# EAGLE schematic dbt_shield_v2_v23 (EAGLE 9.7.0)

## Sheet 1 of 4
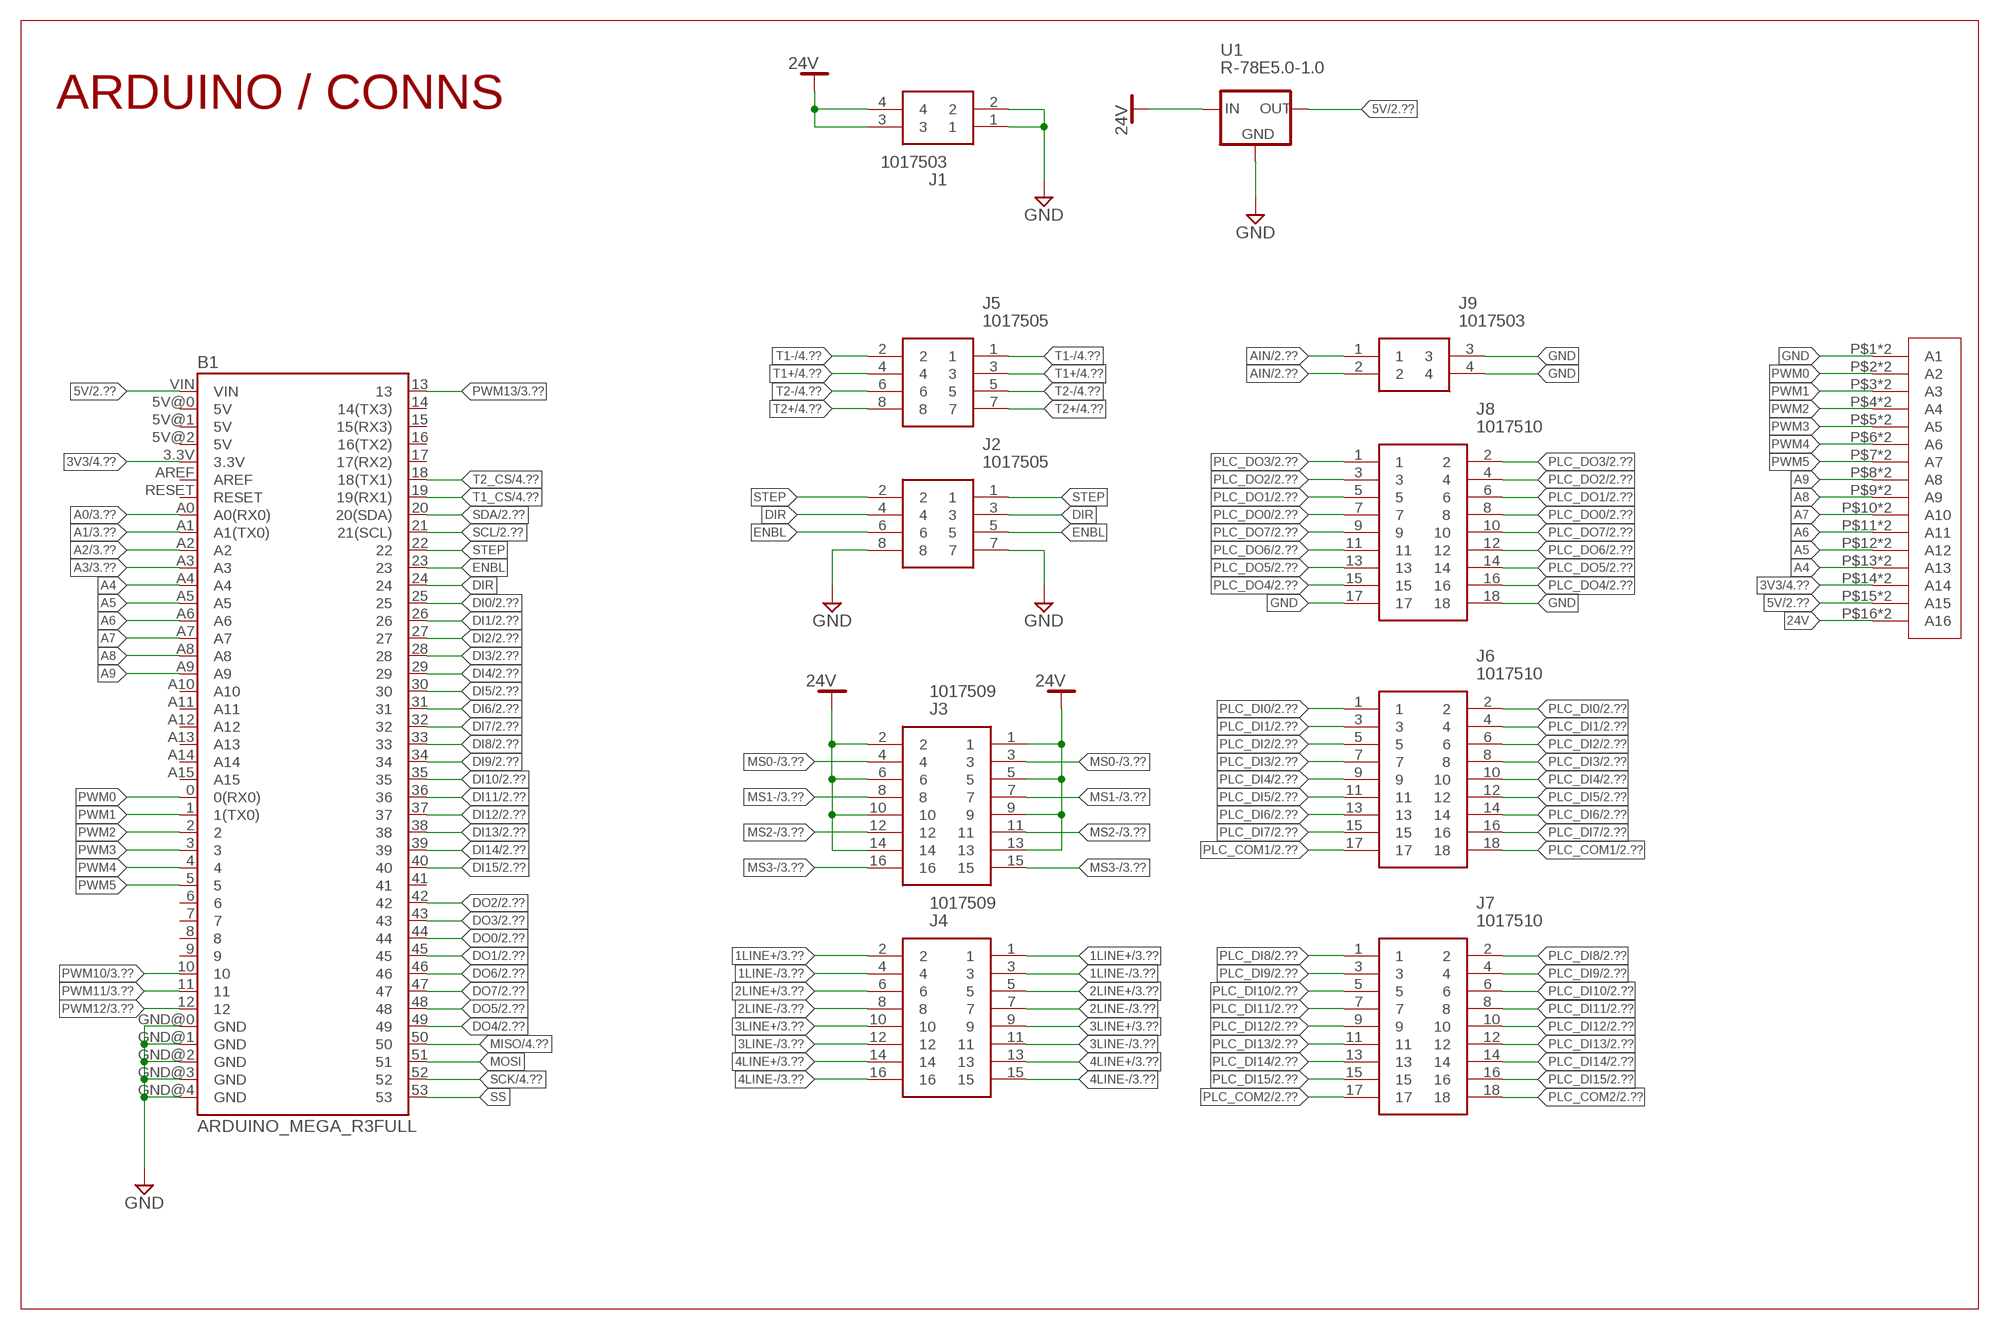
[diagram p0: schematic, sheet 1]

### Parts
B1  ARDUINO_MEGA_R3FULL  [ARDUINO_MEGA]
J1  1017503  [1017503]
J2  1017505  [1017505]
J3  1017509  [1017509]
J4  1017509  [1017509]
J5  1017505  [1017505]
J6  1017510  [SHDR18W120P870X508_2X9_4652X18]
J7  1017510  [SHDR18W120P870X508_2X9_4652X18]
J8  1017510  [SHDR18W120P870X508_2X9_4652X18]
J9  1017503  [1017503]
U1  R-78E5.0-1.0  [DC-DC_CONVERTER_78XX]
U$1  1861991  [1861991]

### Nets
1LINE+: J4.1 J4.2 ; also sheet 3
1LINE-: J4.3 J4.4 ; also sheet 3
2LINE+: J4.5 J4.6 ; also sheet 3
2LINE-: J4.7 J4.8 ; also sheet 3
3LINE+: J4.9 J4.10 ; also sheet 3
3LINE-: J4.11 J4.12 ; also sheet 3
3V3: B1.3.3V U$1.P$14(A14) U$1.P$30(A14) ; also sheet 4
4LINE+: J4.13 J4.14 ; also sheet 3
4LINE-: J4.15 J4.16 ; also sheet 3
5V: B1.VIN U1.VOUT(OUT) U$1.P$15(A15) U$1.P$31(A15) ; also sheet 2,3
24V: J1.3 J1.4 J3.1 J3.2 J3.5 J3.6 J3.9 J3.10 J3.13 J3.14 U1.VIN(IN) U$1.P$16(A16) U$1.P$32(A16) ; also sheet 2,3
A0: B1.A0(A0(RX0)) ; also sheet 3
A1: B1.A1(A1(TX0)) ; also sheet 3
A2: B1.A2 ; also sheet 3
A3: B1.A3 ; also sheet 3
A4: B1.A4 U$1.P$13(A13) U$1.P$29(A13)
A5: B1.A5 U$1.P$12(A12) U$1.P$28(A12)
A6: B1.A6 U$1.P$11(A11) U$1.P$27(A11)
A7: B1.A7 U$1.P$10(A10) U$1.P$26(A10)
A8: B1.A8 U$1.P$9(A9) U$1.P$25(A9)
A9: B1.A9 U$1.P$8(A8) U$1.P$24(A8)
AIN: J9.1 J9.2 ; also sheet 2
DI0: B1.25 ; also sheet 2
DI1: B1.26 ; also sheet 2
DI2: B1.27 ; also sheet 2
DI3: B1.28 ; also sheet 2
DI4: B1.29 ; also sheet 2
DI5: B1.30 ; also sheet 2
DI6: B1.31 ; also sheet 2
DI7: B1.32 ; also sheet 2
DI8: B1.33 ; also sheet 2
DI9: B1.34 ; also sheet 2
DI10: B1.35 ; also sheet 2
DI11: B1.36 ; also sheet 2
DI12: B1.37 ; also sheet 2
DI13: B1.38 ; also sheet 2
DI14: B1.39 ; also sheet 2
DI15: B1.40 ; also sheet 2
DIR: B1.24 J2.3 J2.4
DO0: B1.44 ; also sheet 2
DO1: B1.45 ; also sheet 2
DO2: B1.42 ; also sheet 2
DO3: B1.43 ; also sheet 2
DO4: B1.49 ; also sheet 2
DO5: B1.48 ; also sheet 2
DO6: B1.46 ; also sheet 2
DO7: B1.47 ; also sheet 2
ENBL: B1.23 J2.5 J2.6
GND: B1.GND@0(GND) B1.GND@1(GND) B1.GND@2(GND) B1.GND@3(GND) B1.GND@4(GND) J1.1 J1.2 J2.7 J2.8 J8.17 J8.18 J9.3 J9.4 U1.GND U$1.P$1(A1) U$1.P$17(A1) ; also sheet 2,3,4
MISO: B1.50 ; also sheet 4
MOSI: B1.51
MS0-: J3.3 J3.4 ; also sheet 3
MS1-: J3.7 J3.8 ; also sheet 3
MS2-: J3.11 J3.12 ; also sheet 3
MS3-: J3.15 J3.16 ; also sheet 3
PLC_COM1: J6.17 J6.18 ; also sheet 2
PLC_COM2: J7.17 J7.18 ; also sheet 2
PLC_DI0: J6.1 J6.2 ; also sheet 2
PLC_DI1: J6.3 J6.4 ; also sheet 2
PLC_DI2: J6.5 J6.6 ; also sheet 2
PLC_DI3: J6.7 J6.8 ; also sheet 2
PLC_DI4: J6.9 J6.10 ; also sheet 2
PLC_DI5: J6.11 J6.12 ; also sheet 2
PLC_DI6: J6.13 J6.14 ; also sheet 2
PLC_DI7: J6.15 J6.16 ; also sheet 2
PLC_DI8: J7.1 J7.2 ; also sheet 2
PLC_DI9: J7.3 J7.4 ; also sheet 2
PLC_DI10: J7.5 J7.6 ; also sheet 2
PLC_DI11: J7.7 J7.8 ; also sheet 2
PLC_DI12: J7.9 J7.10 ; also sheet 2
PLC_DI13: J7.11 J7.12 ; also sheet 2
PLC_DI14: J7.13 J7.14 ; also sheet 2
PLC_DI15: J7.15 J7.16 ; also sheet 2
PLC_DO0: J8.7 J8.8 ; also sheet 2
PLC_DO1: J8.5 J8.6 ; also sheet 2
PLC_DO2: J8.3 J8.4 ; also sheet 2
PLC_DO3: J8.1 J8.2 ; also sheet 2
PLC_DO4: J8.15 J8.16 ; also sheet 2
PLC_DO5: J8.13 J8.14 ; also sheet 2
PLC_DO6: J8.11 J8.12 ; also sheet 2
PLC_DO7: J8.9 J8.10 ; also sheet 2
PWM0: B1.0(0(RX0)) U$1.P$2(A2) U$1.P$18(A2)
PWM1: B1.1(1(TX0)) U$1.P$3(A3) U$1.P$19(A3)
PWM2: B1.2 U$1.P$4(A4) U$1.P$20(A4)
PWM3: B1.3 U$1.P$5(A5) U$1.P$21(A5)
PWM4: B1.4 U$1.P$6(A6) U$1.P$22(A6)
PWM5: B1.5 U$1.P$7(A7) U$1.P$23(A7)
PWM10: B1.10 ; also sheet 3
PWM11: B1.11 ; also sheet 3
PWM12: B1.12 ; also sheet 3
PWM13: B1.13 ; also sheet 3
SCK: B1.52 ; also sheet 4
SCL: B1.21(21(SCL)) ; also sheet 2
SDA: B1.20(20(SDA)) ; also sheet 2
SS: B1.53
STEP: B1.22 J2.1 J2.2
T1+: J5.3 J5.4 ; also sheet 4
T1-: J5.1 J5.2 ; also sheet 4
T1_CS: B1.19(19(RX1)) ; also sheet 4
T2+: J5.7 J5.8 ; also sheet 4
T2-: J5.5 J5.6 ; also sheet 4
T2_CS: B1.18(18(TX1)) ; also sheet 4
Unconnected: B1.5V@0(5V) B1.5V@1(5V) B1.5V@2(5V) B1.6 B1.7 B1.8 B1.9 B1.14(14(TX3)) B1.15(15(RX3)) B1.16(16(TX2)) B1.17(17(RX2)) B1.41 B1.A10 B1.A11 B1.A12 B1.A13 B1.A14 B1.A15 B1.AREF B1.RESET

### Notes on the sheet
- ARDUINO / CONNS

## Sheet 2 of 4
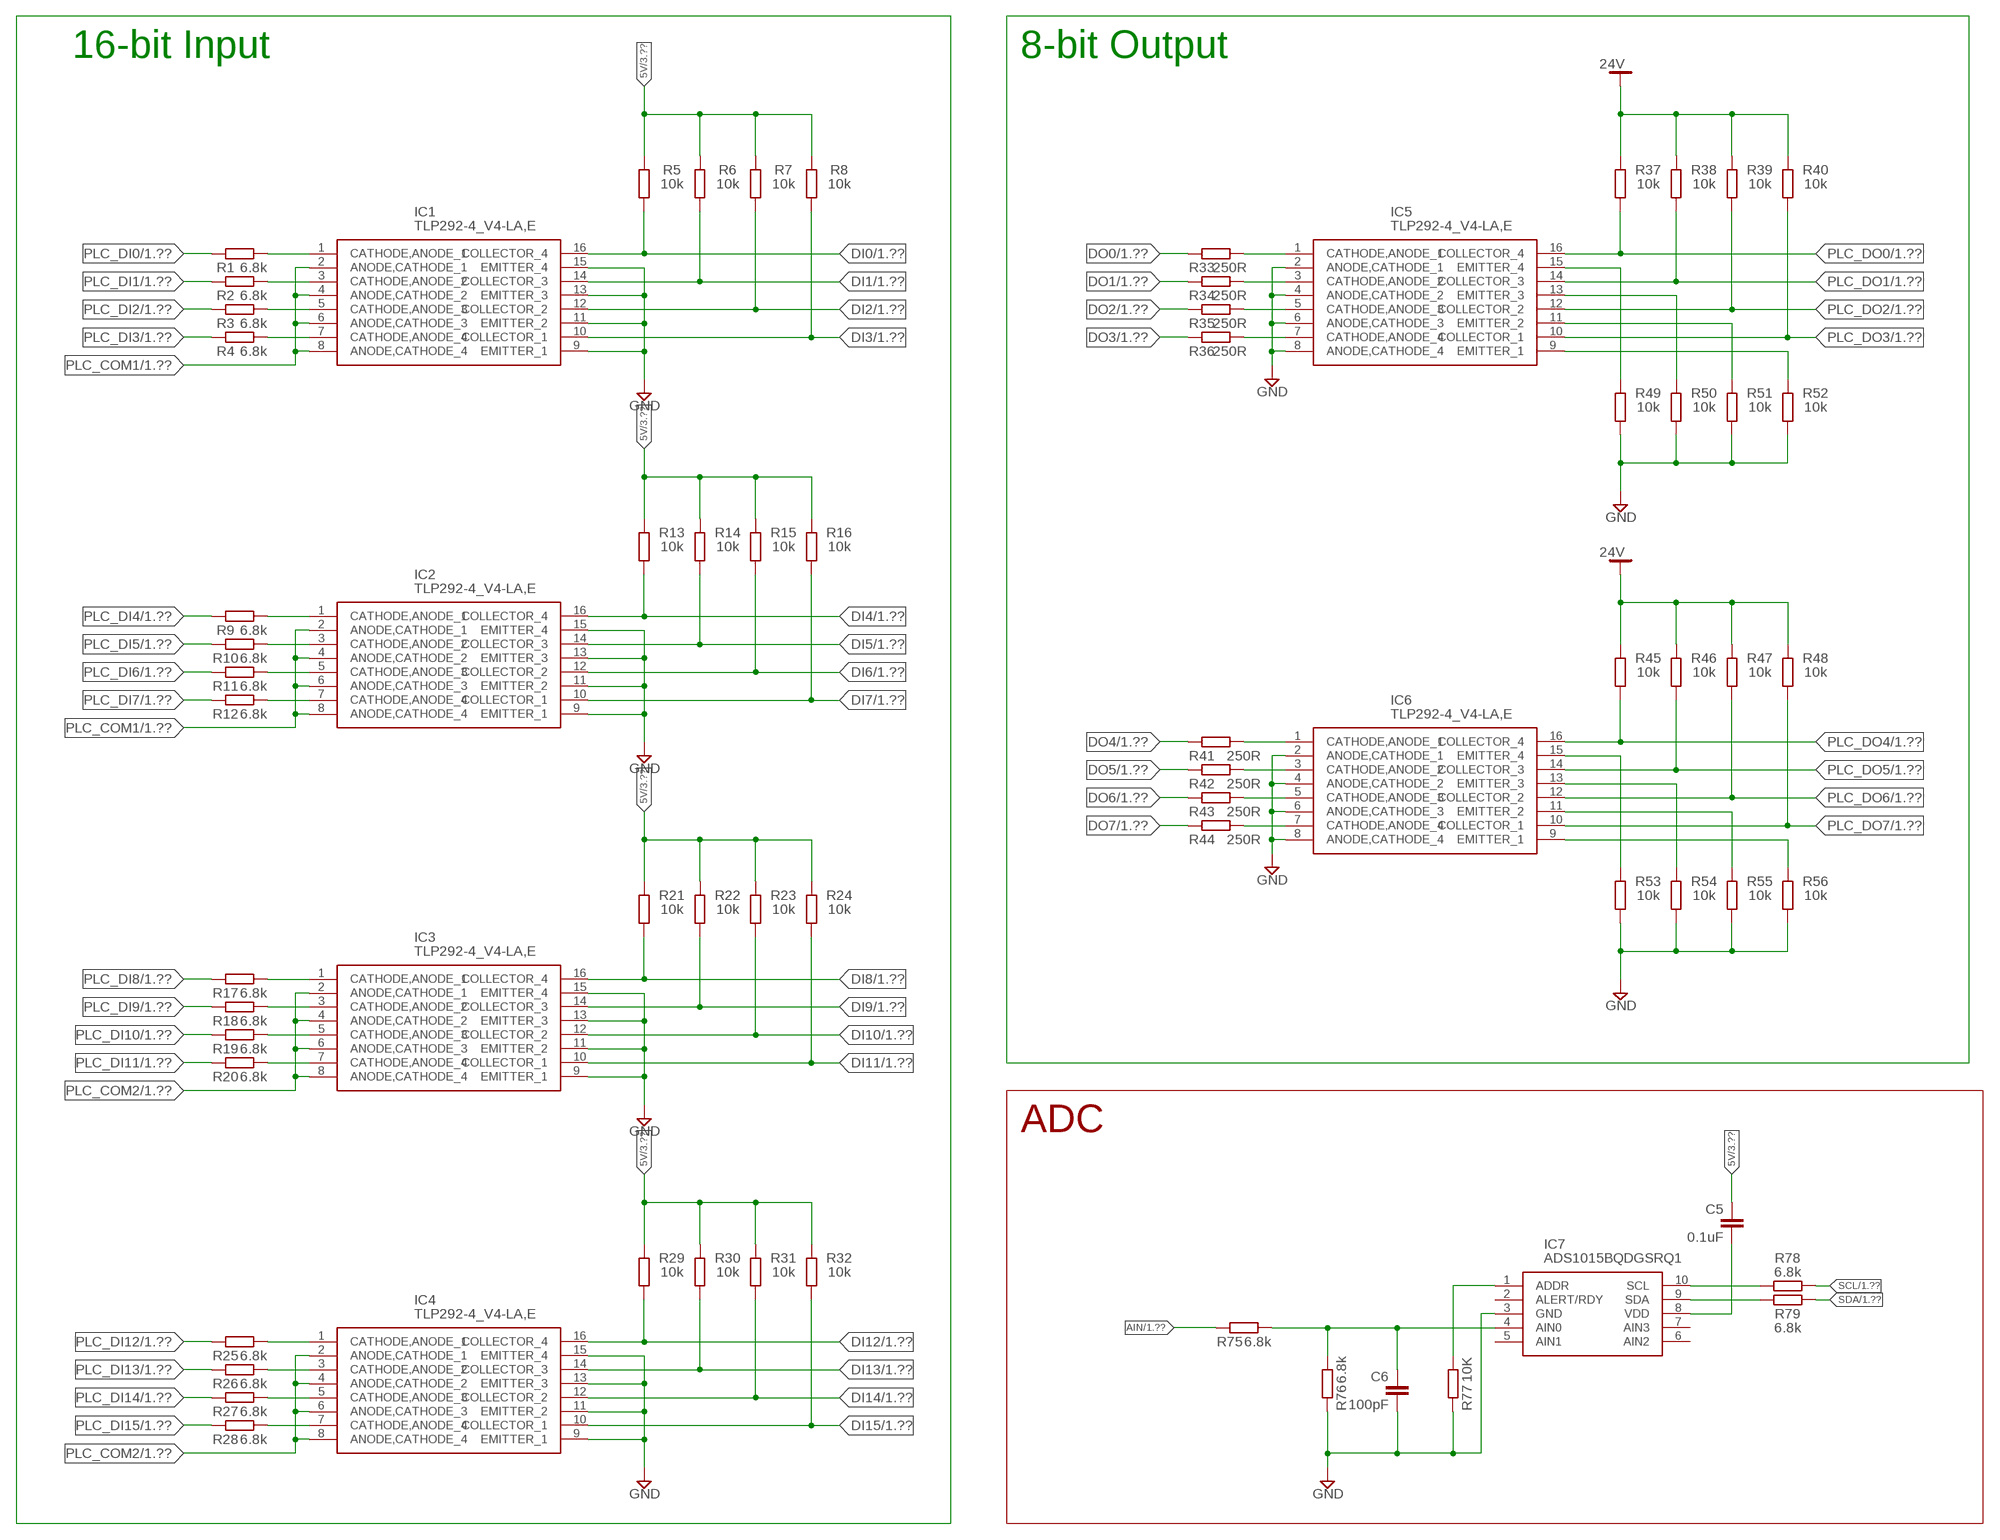
[diagram p1: schematic, sheet 2]

### Parts
C5  0.1uF  C_CHIP-1206(3216-METRIC)  [CAPC3216X135]
C6  100pF  C_CHIP-1206(3216-METRIC)  [CAPC3216X135]
IC1  TLP292-4_V4-LA,E  [SOIC127P700X230-16N]
IC2  TLP292-4_V4-LA,E  [SOIC127P700X230-16N]
IC3  TLP292-4_V4-LA,E  [SOIC127P700X230-16N]
IC4  TLP292-4_V4-LA,E  [SOIC127P700X230-16N]
IC5  TLP292-4_V4-LA,E  [SOIC127P700X230-16N]
IC6  TLP292-4_V4-LA,E  [SOIC127P700X230-16N]
IC7  ADS1015BQDGSRQ1  [SOP50P490X110-10N]
R1  6.8k  R_CHIP-1206(3216-METRIC)  [RESC3216X70]
R2  6.8k  R_CHIP-1206(3216-METRIC)  [RESC3216X70]
R3  6.8k  R_CHIP-1206(3216-METRIC)  [RESC3216X70]
R4  6.8k  R_CHIP-1206(3216-METRIC)  [RESC3216X70]
R5  10k  R_CHIP-1206(3216-METRIC)  [RESC3216X70]
R6  10k  R_CHIP-1206(3216-METRIC)  [RESC3216X70]
R7  10k  R_CHIP-1206(3216-METRIC)  [RESC3216X70]
R8  10k  R_CHIP-1206(3216-METRIC)  [RESC3216X70]
R9  6.8k  R_CHIP-1206(3216-METRIC)  [RESC3216X70]
R10  6.8k  R_CHIP-1206(3216-METRIC)  [RESC3216X70]
R11  6.8k  R_CHIP-1206(3216-METRIC)  [RESC3216X70]
R12  6.8k  R_CHIP-1206(3216-METRIC)  [RESC3216X70]
R13  10k  R_CHIP-1206(3216-METRIC)  [RESC3216X70]
R14  10k  R_CHIP-1206(3216-METRIC)  [RESC3216X70]
R15  10k  R_CHIP-1206(3216-METRIC)  [RESC3216X70]
R16  10k  R_CHIP-1206(3216-METRIC)  [RESC3216X70]
R17  6.8k  R_CHIP-1206(3216-METRIC)  [RESC3216X70]
R18  6.8k  R_CHIP-1206(3216-METRIC)  [RESC3216X70]
R19  6.8k  R_CHIP-1206(3216-METRIC)  [RESC3216X70]
R20  6.8k  R_CHIP-1206(3216-METRIC)  [RESC3216X70]
R21  10k  R_CHIP-1206(3216-METRIC)  [RESC3216X70]
R22  10k  R_CHIP-1206(3216-METRIC)  [RESC3216X70]
R23  10k  R_CHIP-1206(3216-METRIC)  [RESC3216X70]
R24  10k  R_CHIP-1206(3216-METRIC)  [RESC3216X70]
R25  6.8k  R_CHIP-1206(3216-METRIC)  [RESC3216X70]
R26  6.8k  R_CHIP-1206(3216-METRIC)  [RESC3216X70]
R27  6.8k  R_CHIP-1206(3216-METRIC)  [RESC3216X70]
R28  6.8k  R_CHIP-1206(3216-METRIC)  [RESC3216X70]
R29  10k  R_CHIP-1206(3216-METRIC)  [RESC3216X70]
R30  10k  R_CHIP-1206(3216-METRIC)  [RESC3216X70]
R31  10k  R_CHIP-1206(3216-METRIC)  [RESC3216X70]
R32  10k  R_CHIP-1206(3216-METRIC)  [RESC3216X70]
R33  250R  R_CHIP-1206(3216-METRIC)  [RESC3216X70]
R34  250R  R_CHIP-1206(3216-METRIC)  [RESC3216X70]
R35  250R  R_CHIP-1206(3216-METRIC)  [RESC3216X70]
R36  250R  R_CHIP-1206(3216-METRIC)  [RESC3216X70]
R37  10k  R_CHIP-1206(3216-METRIC)  [RESC3216X70]
R38  10k  R_CHIP-1206(3216-METRIC)  [RESC3216X70]
R39  10k  R_CHIP-1206(3216-METRIC)  [RESC3216X70]
R40  10k  R_CHIP-1206(3216-METRIC)  [RESC3216X70]
R41  250R  R_CHIP-1206(3216-METRIC)  [RESC3216X70]
R42  250R  R_CHIP-1206(3216-METRIC)  [RESC3216X70]
R43  250R  R_CHIP-1206(3216-METRIC)  [RESC3216X70]
R44  250R  R_CHIP-1206(3216-METRIC)  [RESC3216X70]
R45  10k  R_CHIP-1206(3216-METRIC)  [RESC3216X70]
R46  10k  R_CHIP-1206(3216-METRIC)  [RESC3216X70]
R47  10k  R_CHIP-1206(3216-METRIC)  [RESC3216X70]
R48  10k  R_CHIP-1206(3216-METRIC)  [RESC3216X70]
R49  10k  R_CHIP-1206(3216-METRIC)  [RESC3216X70]
R50  10k  R_CHIP-1206(3216-METRIC)  [RESC3216X70]
R51  10k  R_CHIP-1206(3216-METRIC)  [RESC3216X70]
R52  10k  R_CHIP-1206(3216-METRIC)  [RESC3216X70]
R53  10k  R_CHIP-1206(3216-METRIC)  [RESC3216X70]
R54  10k  R_CHIP-1206(3216-METRIC)  [RESC3216X70]
R55  10k  R_CHIP-1206(3216-METRIC)  [RESC3216X70]
R56  10k  R_CHIP-1206(3216-METRIC)  [RESC3216X70]
R75  6.8k  R_CHIP-1206(3216-METRIC)  [RESC3216X70]
R76  6.8k  R_CHIP-1206(3216-METRIC)  [RESC3216X70]
R77  10K  R_CHIP-1206(3216-METRIC)  [RESC3216X70]
R78  6.8k  R_CHIP-1206(3216-METRIC)  [RESC3216X70]
R79  6.8k  R_CHIP-1206(3216-METRIC)  [RESC3216X70]

### Nets
5V: C5.1 R5.2 R6.2 R7.2 R8.2 R13.2 R14.2 R15.2 R16.2 R21.2 R22.2 R23.2 R24.2 R29.2 R30.2 R31.2 R32.2 ; also sheet 1,3
24V: R37.2 R38.2 R39.2 R40.2 R45.2 R46.2 R47.2 R48.2 ; also sheet 1,3
AIN: R75.1 ; also sheet 1
DI0: IC1.16(COLLECTOR_4) R5.1 ; also sheet 1
DI1: IC1.14(COLLECTOR_3) R6.1 ; also sheet 1
DI2: IC1.12(COLLECTOR_2) R7.1 ; also sheet 1
DI3: IC1.10(COLLECTOR_1) R8.1 ; also sheet 1
DI4: IC2.16(COLLECTOR_4) R13.1 ; also sheet 1
DI5: IC2.14(COLLECTOR_3) R14.1 ; also sheet 1
DI6: IC2.12(COLLECTOR_2) R15.1 ; also sheet 1
DI7: IC2.10(COLLECTOR_1) R16.1 ; also sheet 1
DI8: IC3.16(COLLECTOR_4) R21.1 ; also sheet 1
DI9: IC3.14(COLLECTOR_3) R22.1 ; also sheet 1
DI10: IC3.12(COLLECTOR_2) R23.1 ; also sheet 1
DI11: IC3.10(COLLECTOR_1) R24.1 ; also sheet 1
DI12: IC4.16(COLLECTOR_4) R29.1 ; also sheet 1
DI13: IC4.14(COLLECTOR_3) R30.1 ; also sheet 1
DI14: IC4.12(COLLECTOR_2) R31.1 ; also sheet 1
DI15: IC4.10(COLLECTOR_1) R32.1 ; also sheet 1
DO0: R33.1 ; also sheet 1
DO1: R34.1 ; also sheet 1
DO2: R35.1 ; also sheet 1
DO3: R36.1 ; also sheet 1
DO4: R41.1 ; also sheet 1
DO5: R42.1 ; also sheet 1
DO6: R43.1 ; also sheet 1
DO7: R44.1 ; also sheet 1
GND: C6.2 IC1.9(EMITTER_1) IC1.11(EMITTER_2) IC1.13(EMITTER_3) IC1.15(EMITTER_4) IC2.9(EMITTER_1) IC2.11(EMITTER_2) IC2.13(EMITTER_3) IC2.15(EMITTER_4) IC3.9(EMITTER_1) IC3.11(EMITTER_2) IC3.13(EMITTER_3) IC3.15(EMITTER_4) IC4.9(EMITTER_1) IC4.11(EMITTER_2) IC4.13(EMITTER_3) IC4.15(EMITTER_4) IC5.2(ANODE,CATHODE_1) IC5.4(ANODE,CATHODE_2) IC5.6(ANODE,CATHODE_3) IC5.8(ANODE,CATHODE_4) IC6.2(ANODE,CATHODE_1) IC6.4(ANODE,CATHODE_2) IC6.6(ANODE,CATHODE_3) IC6.8(ANODE,CATHODE_4) IC7.3(GND) R49.1 R50.1 R51.1 R52.1 R53.1 R54.1 R55.1 R56.1 R76.1 R77.1 ; also sheet 1,3,4
N$1: IC1.1(CATHODE,ANODE_1) R1.2
N$2: IC1.3(CATHODE,ANODE_2) R2.2
N$3: IC1.5(CATHODE,ANODE_3) R3.2
N$4: IC1.7(CATHODE,ANODE_4) R4.2
N$5: IC2.1(CATHODE,ANODE_1) R9.2
N$6: IC2.3(CATHODE,ANODE_2) R10.2
N$7: IC2.5(CATHODE,ANODE_3) R11.2
N$8: IC2.7(CATHODE,ANODE_4) R12.2
N$9: IC3.1(CATHODE,ANODE_1) R17.2
N$10: IC3.3(CATHODE,ANODE_2) R18.2
N$11: IC3.5(CATHODE,ANODE_3) R19.2
N$12: IC3.7(CATHODE,ANODE_4) R20.2
N$13: IC4.1(CATHODE,ANODE_1) R25.2
N$14: IC4.3(CATHODE,ANODE_2) R26.2
N$15: IC4.5(CATHODE,ANODE_3) R27.2
N$16: IC4.7(CATHODE,ANODE_4) R28.2
N$17: IC5.1(CATHODE,ANODE_1) R33.2
N$18: IC5.3(CATHODE,ANODE_2) R34.2
N$19: IC5.5(CATHODE,ANODE_3) R35.2
N$20: IC5.7(CATHODE,ANODE_4) R36.2
N$21: IC6.1(CATHODE,ANODE_1) R41.2
N$22: IC6.3(CATHODE,ANODE_2) R42.2
N$23: IC6.5(CATHODE,ANODE_3) R43.2
N$24: IC6.7(CATHODE,ANODE_4) R44.2
N$25: IC5.15(EMITTER_4) R49.2
N$26: IC5.13(EMITTER_3) R50.2
N$27: IC5.11(EMITTER_2) R51.2
N$28: IC5.9(EMITTER_1) R52.2
N$29: IC6.15(EMITTER_4) R53.2
N$30: IC6.13(EMITTER_3) R54.2
N$31: IC6.11(EMITTER_2) R55.2
N$32: IC6.9(EMITTER_1) R56.2
N$47: C6.1 IC7.4(AIN0) R75.2 R76.2
N$56: IC7.1(ADDR) R77.2
N$58: C5.2 IC7.8(VDD)
N$59: IC7.9(SDA) R79.2
N$60: IC7.10(SCL) R78.2
PLC_COM1: IC1.2(ANODE,CATHODE_1) IC1.4(ANODE,CATHODE_2) IC1.6(ANODE,CATHODE_3) IC1.8(ANODE,CATHODE_4) IC2.2(ANODE,CATHODE_1) IC2.4(ANODE,CATHODE_2) IC2.6(ANODE,CATHODE_3) IC2.8(ANODE,CATHODE_4) ; also sheet 1
PLC_COM2: IC3.2(ANODE,CATHODE_1) IC3.4(ANODE,CATHODE_2) IC3.6(ANODE,CATHODE_3) IC3.8(ANODE,CATHODE_4) IC4.2(ANODE,CATHODE_1) IC4.4(ANODE,CATHODE_2) IC4.6(ANODE,CATHODE_3) IC4.8(ANODE,CATHODE_4) ; also sheet 1
PLC_DI0: R1.1 ; also sheet 1
PLC_DI1: R2.1 ; also sheet 1
PLC_DI2: R3.1 ; also sheet 1
PLC_DI3: R4.1 ; also sheet 1
PLC_DI4: R9.1 ; also sheet 1
PLC_DI5: R10.1 ; also sheet 1
PLC_DI6: R11.1 ; also sheet 1
PLC_DI7: R12.1 ; also sheet 1
PLC_DI8: R17.1 ; also sheet 1
PLC_DI9: R18.1 ; also sheet 1
PLC_DI10: R19.1 ; also sheet 1
PLC_DI11: R20.1 ; also sheet 1
PLC_DI12: R25.1 ; also sheet 1
PLC_DI13: R26.1 ; also sheet 1
PLC_DI14: R27.1 ; also sheet 1
PLC_DI15: R28.1 ; also sheet 1
PLC_DO0: IC5.16(COLLECTOR_4) R37.1 ; also sheet 1
PLC_DO1: IC5.14(COLLECTOR_3) R38.1 ; also sheet 1
PLC_DO2: IC5.12(COLLECTOR_2) R39.1 ; also sheet 1
PLC_DO3: IC5.10(COLLECTOR_1) R40.1 ; also sheet 1
PLC_DO4: IC6.16(COLLECTOR_4) R45.1 ; also sheet 1
PLC_DO5: IC6.14(COLLECTOR_3) R46.1 ; also sheet 1
PLC_DO6: IC6.12(COLLECTOR_2) R47.1 ; also sheet 1
PLC_DO7: IC6.10(COLLECTOR_1) R48.1 ; also sheet 1
SCL: R78.1 ; also sheet 1
SDA: R79.1 ; also sheet 1
Unconnected: IC7.2(ALERT/RDY) IC7.5(AIN1) IC7.6(AIN2) IC7.7(AIN3)

### Notes on the sheet
- 16-bit Input | 8-bit Output
- ADC

## Sheet 3 of 4
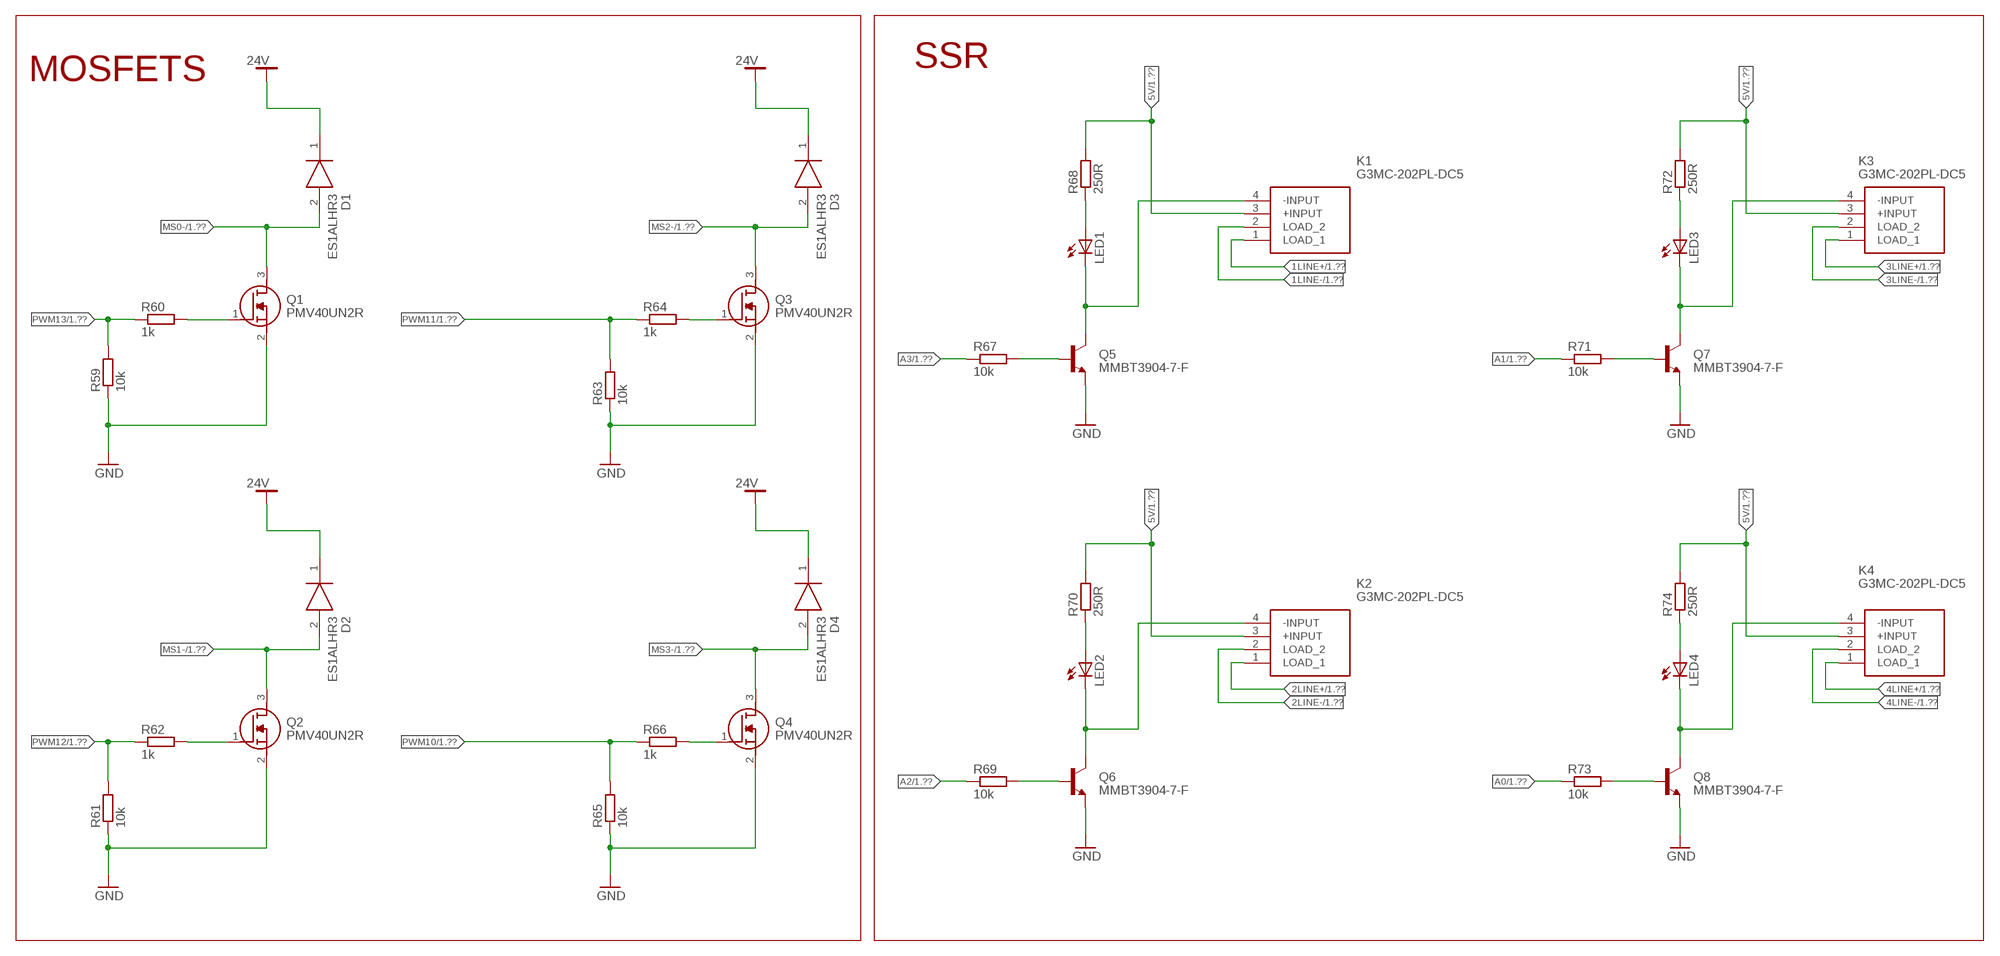
[diagram p2: schematic, sheet 3]

### Parts
D1  ES1ALHR3  [SODFL3618X143N]
D2  ES1ALHR3  [SODFL3618X143N]
D3  ES1ALHR3  [SODFL3618X143N]
D4  ES1ALHR3  [SODFL3618X143N]
K1  G3MC-202PL-DC5  [G3MC202PLDC5]
K2  G3MC-202PL-DC5  [G3MC202PLDC5]
K3  G3MC-202PL-DC5  [G3MC202PLDC5]
K4  G3MC-202PL-DC5  [G3MC202PLDC5]
LED1  LEDCHIPLED_1206  [CHIPLED_1206]
LED2  LEDCHIPLED_1206  [CHIPLED_1206]
LED3  LEDCHIPLED_1206  [CHIPLED_1206]
LED4  LEDCHIPLED_1206  [CHIPLED_1206]
Q1  PMV40UN2R  [SOT95P230X110-3N]
Q2  PMV40UN2R  [SOT95P230X110-3N]
Q3  PMV40UN2R  [SOT95P230X110-3N]
Q4  PMV40UN2R  [SOT95P230X110-3N]
Q5  MMBT3904-7-F  [SOT95P230X110-3N1]
Q6  MMBT3904-7-F  [SOT95P230X110-3N1]
Q7  MMBT3904-7-F  [SOT95P230X110-3N1]
Q8  MMBT3904-7-F  [SOT95P230X110-3N1]
R59  10k  R_CHIP-1206(3216-METRIC)  [RESC3216X70]
R60  1k  R_CHIP-1206(3216-METRIC)  [RESC3216X70]
R61  10k  R_CHIP-1206(3216-METRIC)  [RESC3216X70]
R62  1k  R_CHIP-1206(3216-METRIC)  [RESC3216X70]
R63  10k  R_CHIP-1206(3216-METRIC)  [RESC3216X70]
R64  1k  R_CHIP-1206(3216-METRIC)  [RESC3216X70]
R65  10k  R_CHIP-1206(3216-METRIC)  [RESC3216X70]
R66  1k  R_CHIP-1206(3216-METRIC)  [RESC3216X70]
R67  10k  R_CHIP-1206(3216-METRIC)  [RESC3216X70]
R68  250R  R_CHIP-1206(3216-METRIC)  [RESC3216X70]
R69  10k  R_CHIP-1206(3216-METRIC)  [RESC3216X70]
R70  250R  R_CHIP-1206(3216-METRIC)  [RESC3216X70]
R71  10k  R_CHIP-1206(3216-METRIC)  [RESC3216X70]
R72  250R  R_CHIP-1206(3216-METRIC)  [RESC3216X70]
R73  10k  R_CHIP-1206(3216-METRIC)  [RESC3216X70]
R74  250R  R_CHIP-1206(3216-METRIC)  [RESC3216X70]

### Nets
1LINE+: K1.1(LOAD_1) ; also sheet 1
1LINE-: K1.2(LOAD_2) ; also sheet 1
2LINE+: K2.1(LOAD_1) ; also sheet 1
2LINE-: K2.2(LOAD_2) ; also sheet 1
3LINE+: K3.1(LOAD_1) ; also sheet 1
3LINE-: K3.2(LOAD_2) ; also sheet 1
4LINE+: K4.1(LOAD_1) ; also sheet 1
4LINE-: K4.2(LOAD_2) ; also sheet 1
5V: K1.3(+INPUT) K2.3(+INPUT) K3.3(+INPUT) K4.3(+INPUT) R68.2 R70.2 R72.2 R74.2 ; also sheet 1,2
24V: D1.1(K) D2.1(K) D3.1(K) D4.1(K) ; also sheet 1,2
A0: R73.1 ; also sheet 1
A1: R71.1 ; also sheet 1
A2: R69.1 ; also sheet 1
A3: R67.1 ; also sheet 1
GND: Q1.2(S) Q2.2(S) Q3.2(S) Q4.2(S) Q5.E Q6.E Q7.E Q8.E R59.1 R61.1 R63.1 R65.1 ; also sheet 1,2,4
MS0-: D1.2(A) Q1.3(D) ; also sheet 1
MS1-: D2.2(A) Q2.3(D) ; also sheet 1
MS2-: D3.2(A) Q3.3(D) ; also sheet 1
MS3-: D4.2(A) Q4.3(D) ; also sheet 1
N$38: Q1.1(G) R60.2
N$40: Q2.1(G) R62.2
N$41: Q3.1(G) R64.2
N$42: Q4.1(G) R66.2
N$43: LED1.A R68.1
N$44: K1.4(-INPUT) LED1.C Q5.C
N$45: Q5.B R67.2
N$46: LED2.A R70.1
N$48: K2.4(-INPUT) LED2.C Q6.C
N$49: Q6.B R69.2
N$50: LED3.A R72.1
N$51: K3.4(-INPUT) LED3.C Q7.C
N$52: Q7.B R71.2
N$53: LED4.A R74.1
N$54: K4.4(-INPUT) LED4.C Q8.C
N$55: Q8.B R73.2
PWM10: R65.2 R66.1 ; also sheet 1
PWM11: R63.2 R64.1 ; also sheet 1
PWM12: R61.2 R62.1 ; also sheet 1
PWM13: R59.2 R60.1 ; also sheet 1

### Notes on the sheet
- SSR
- MOSFETS

## Sheet 4 of 4
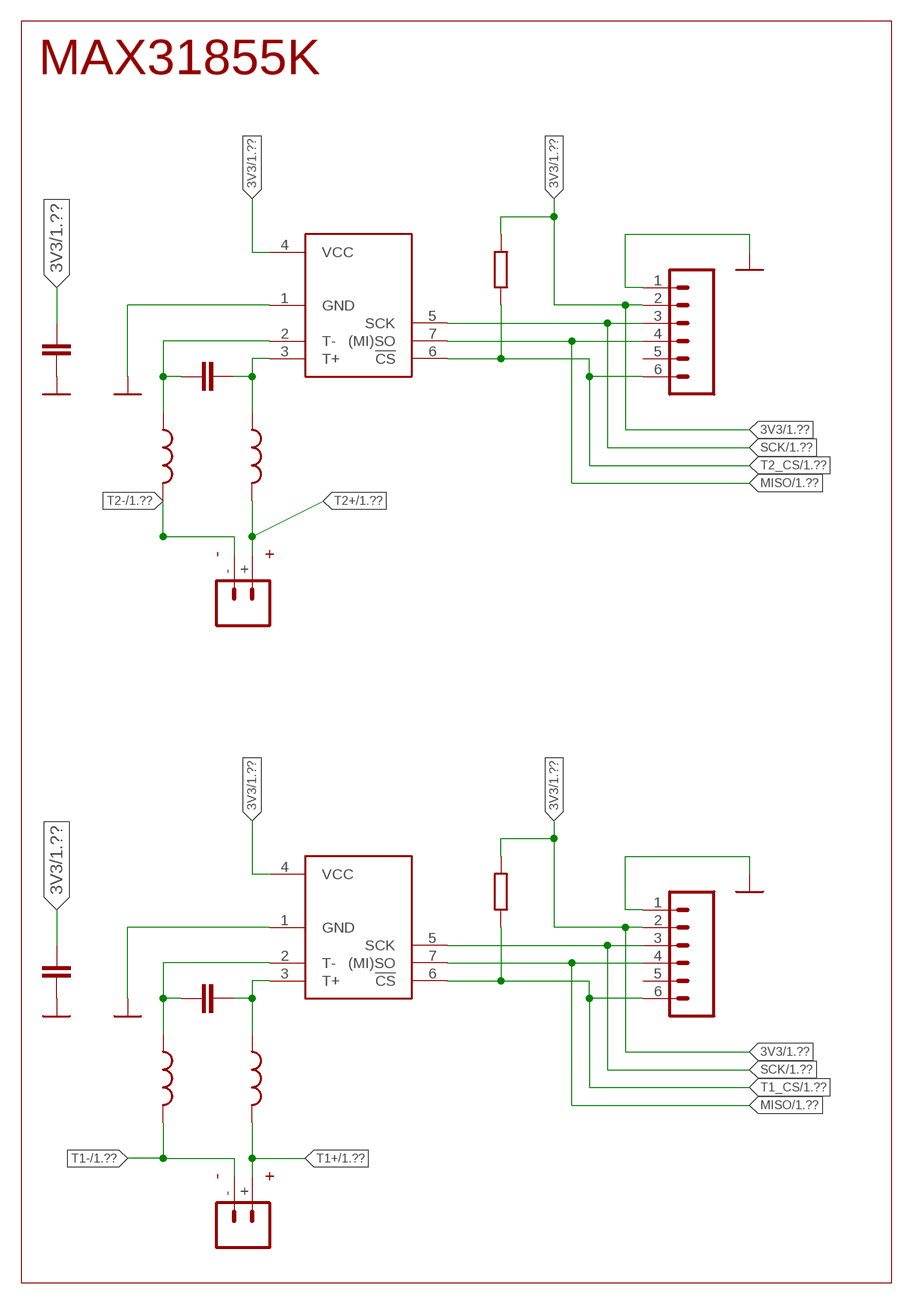
[diagram p3: schematic, sheet 4]

### Parts
C1  0.1uF  C_CHIP-1206(3216-METRIC)  [CAPC3216X135]
C2  10 nF  C_CHIP-1206(3216-METRIC)  [CAPC3216X135]
C3  0.1uF  C_CHIP-1206(3216-METRIC)  [CAPC3216X135]
C4  10 nF  C_CHIP-1206(3216-METRIC)  [CAPC3216X135]
JP1  DNP  M06SILK_FEMALE_PTH  [1X06]
JP2  PCB_THERMOCOUPLE  [PCC-SMP]
JP3  DNP  M06SILK_FEMALE_PTH  [1X06]
JP4  PCB_THERMOCOUPLE  [PCC-SMP]
L1  470 OHM  L_CHIP-1206(3216-METRIC)  [INDC3216X190]
L2  470 OHM  L_CHIP-1206(3216-METRIC)  [INDC3216X190]
L3  470 OHM  L_CHIP-1206(3216-METRIC)  [INDC3216X190]
L4  470 OHM  L_CHIP-1206(3216-METRIC)  [INDC3216X190]
R57  10k  R_CHIP-1206(3216-METRIC)  [RESC3216X70]
R58  10k  R_CHIP-1206(3216-METRIC)  [RESC3216X70]
U2  MAX31855K  [SOIC8]
U3  MAX31855K  [SOIC8]

### Nets
3V3: C1.1 C3.1 JP1.2 JP3.2 R57.2 R58.2 U2.4(VCC) U3.4(VCC) ; also sheet 1
GND: C1.2 C3.2 JP1.1 JP3.1 U2.1(GND) U3.1(GND) ; also sheet 1,2,3
MISO: JP1.4 JP3.4 U2.7((MI)SO) U3.7((MI)SO) ; also sheet 1
N$35: C2.1 L2.1 U2.3(T+)
N$36: C4.1 L4.1 U3.3(T+)
N$37: C4.2 L3.1 U3.2(T-)
N$39: C2.2 L1.1 U2.2(T-)
SCK: JP1.3 JP3.3 U2.5(SCK) U3.5(SCK) ; also sheet 1
T1+: JP2.+ L2.2 ; also sheet 1
T1-: JP2.- L1.2 ; also sheet 1
T1_CS: JP1.6 R57.1 U2.6(!CS) ; also sheet 1
T2+: JP4.+ L4.2 ; also sheet 1
T2-: JP4.- L3.2 ; also sheet 1
T2_CS: JP3.6 R58.1 U3.6(!CS) ; also sheet 1
Unconnected: JP1.5 JP2.CLIP1 JP2.CLIP2 JP3.5 JP4.CLIP1 JP4.CLIP2

### Notes on the sheet
- MAX31855K

## Library data of the parts
B1 = dbt_shield:ARDUINO_MEGA_R3: Arduino Mega R3 ATmega2560 R3 compatible footprint. SparkFun Products: Arduino Mega 2560 R3 <https://www.sparkfun.com/products/11061>
C1-C6 = Capacitor:C: Capacitor - Generic; CATEGORY: Capacitor
D1-D4 = dbt_shield:ES1ALHR3: Rectifiers 1A, 50V, SUPER FAST SM RECTIFIER Source: Datasheet <https://componentsearchengine.com/Datasheets/1/ES1ALHR3.pdf>; DESCRIPTION: Rectifiers 1A, 50V, SUPER FAST SM RECTIFIER; HEIGHT: 1.43mm; MANUFACTURER_NAME: Taiwan Semiconductor; MANUFACTURER_PART_NUMBER: ES1ALHR3; MOUSER_PART_NUMBER: 821-ES1ALHR3; MOUSER_PRICE-STOCK: https://www.mouser.co.uk/ProductDetail/Taiwan-Semiconductor/ES1ALHR3?qs=70cth9uAySfs%2F8RIhd19cA%3D%3D
IC1-IC6 = dbt_shield:TLP292-4_V4-LA,E: Transistor Output Optocouplers 4ch Transistor opto coupler Source: Datasheet <https://toshiba.semicon-storage.com/info/docget.jsp?did=15284&prodName=TLP292-4>; DESCRIPTION: Transistor Output Optocouplers 4ch Transistor opto coupler; HEIGHT: 2.3mm; MANUFACTURER_NAME: Toshiba; MANUFACTURER_PART_NUMBER: TLP292-4(V4-LA,E; MOUSER_PART_NUMBER: 757-TLP292-4V4-LAE; MOUSER_PRICE-STOCK: https://www.mouser.com/Search/Refine.aspx?Keyword=757-TLP292-4V4-LAE
IC7 = ADS1015BQDGSRQ1:ADS1015BQDGSRQ1: Automotive 12-Bit 3.3kSPS 4-Ch Delta-Sigma ADC With PGA, Oscillator, VREF, Comparator, and I2C Source: Datasheet <http://www.ti.com/lit/gpn/ads1015-q1>; ARROW_PART_NUMBER: ADS1015BQDGSRQ1; ARROW_PRICE-STOCK: https://www.arrow.com/en/products/ads1015bqdgsrq1/texas-instruments; DESCRIPTION: Automotive 12-Bit 3.3kSPS 4-Ch Delta-Sigma ADC With PGA, Oscillator, VREF, Comparator, and I2C; HEIGHT: 1.1mm; MANUFACTURER_NAME: Texas Instruments; MANUFACTURER_PART_NUMBER: ADS1015BQDGSRQ1; MOUSER_PART_NUMBER: 595-ADS1015BQDGSRQ1; MOUSER_PRICE-STOCK: https://www.mouser.co.uk/ProductDetail/Texas-Instruments/ADS1015BQDGSRQ1?qs=34RfhUjJmKfZv563%2FD593g%3D%3D
J1 J9 = dbt_shield:1017503: Phoenix Contact TDPT Series 5.08mm Pitch, PCB Terminal Block, PCB Mount, 2 Way Source: Datasheet <https://www.phoenixcontact.com/online/portal/gb?uri=pxc-oc-itemdetail:pid=1017503&library=gben&tab=1>; ARROW_PART_NUMBER: 1017503; ARROW_PRICE-STOCK: https://www.arrow.com/en/products/1017503/phoenix-contact; DESCRIPTION: Phoenix Contact TDPT Series 5.08mm Pitch, PCB Terminal Block, PCB Mount, 2 Way; HEIGHT: 19.2mm; MANUFACTURER_NAME: Phoenix Contact; MANUFACTURER_PART_NUMBER: 1017503; MOUSER_PART_NUMBER: 651-1017503; MOUSER_PRICE-STOCK: https://www.mouser.co.uk/ProductDetail/Phoenix-Contact/1017503?qs=F5EMLAvA7ICurcWsoxF7Hw%3D%3D
J2 J5 = dbt_shield:1017505: Phoenix Contact TDPT Series 5.08mm Pitch, PCB Terminal Block, PCB Mount, 4 Way Source: Datasheet <https://www.phoenixcontact.com/online/portal/gb/?uri=pxc-oc-itemdetail:pid=1017505&library=gben&pcck=P-11-01-05&tab=1&selectedCategory=ALL>; ALLIED_NUMBER: 71241694; ALLIED_PRICE-STOCK: https://www.alliedelec.com/phoenixcontact-1017505/71241694/; DESCRIPTION: Phoenix Contact TDPT Series 5.08mm Pitch, PCB Terminal Block, PCB Mount, 4 Way; HEIGHT: 19.2mm; MANUFACTURER_NAME: Phoenix Contact; MANUFACTURER_PART_NUMBER: 1017505; MOUSER_PART_NUMBER: 651-1017505; MOUSER_PRICE-STOCK: https://www.mouser.com/Search/Refine.aspx?Keyword=651-1017505; RS_PART_NUMBER: 1753922; RS_PRICE-STOCK: http://uk.rs-online.com/web/p/products/1753922
J3 J4 = dbt_shield:1017509: Phoenix Contact TDPT Series 5.08mm Pitch, PCB Terminal Block, PCB Mount, 8 Way Source: Datasheet <https://www.phoenixcontact.com/online/portal/gb?uri=pxc-oc-itemdetail:pid=1017509&library=gben&tab=1>; ALLIED_NUMBER: 71241695; ALLIED_PRICE-STOCK: https://www.alliedelec.com/phoenixcontact-1017509/71241695/; DESCRIPTION: Phoenix Contact TDPT Series 5.08mm Pitch, PCB Terminal Block, PCB Mount, 8 Way; HEIGHT: 19.2mm; MANUFACTURER_NAME: Phoenix Contact; MANUFACTURER_PART_NUMBER: 1017509; MOUSER_PART_NUMBER: 651-1017509; MOUSER_PRICE-STOCK: https://www.mouser.com/Search/Refine.aspx?Keyword=651-1017509; RS_PART_NUMBER: 1753943P; RS_PRICE-STOCK: http://uk.rs-online.com/web/p/products/1753943P
J6-J8 = dbt_shield:1017510: Phoenix Contact TDPT 2.5/ 9-SP-5.08, 9 Way PCB Terminal Block Source: Datasheet <https://www.phoenixcontact.com/online/portal/ie?uri=pxc-oc-itemdetail:pid=1017510&library=ieen&tab=1>; ALLIED_NUMBER: 71241705; ALLIED_PRICE-STOCK: https://www.alliedelec.com/phoenixcontact-1017510/71241705/; DESCRIPTION: Phoenix Contact TDPT 2.5/ 9-SP-5.08, 9 Way PCB Terminal Block; HEIGHT: 19.2mm; MANUFACTURER_NAME: Phoenix Contact; MANUFACTURER_PART_NUMBER: 1017510; MOUSER_PART_NUMBER: 651-1017510; MOUSER_PRICE-STOCK: https://www.mouser.com/Search/Refine.aspx?Keyword=651-1017510; RS_PART_NUMBER: 1753946P; RS_PRICE-STOCK: http://uk.rs-online.com/web/p/products/1753946P
JP1 JP3 = SparkFun-Connectors:M06: Header 6 Standard 6-pin 0.1" header. Use with straight break away headers (SKU : PRT-00116), right angle break away headers (PRT-00553), swiss pins (PRT-00743), machine pins (PRT-00117), and female headers (PRT-00115). Molex polarized connector foot print use with SKU : PRT-08094 with associated crimp pins and housings. NOTES ON THE VARIANTS LOCK and LOCK_LONGPADS... This footprint was designed to help hold the alignment of a through-hole component (i.e. 6-pin header) while soldering it into place. You may notice that each hole has been shifted either up or down by 0.005 of an inch from it's more standard position (which is a perfectly straight line). This slight alteration caused the pins (the squares in the middle) to touch the edges of the holes. Because they are alternating, it causes a "brace" to hold the component in place. 0.005 has proven to be the perfect amount of "off-center" position when using our standard breakaway headers. Although looks a little odd when you look at the bare footprint, once you have a header in there, the alteration is very hard to notice. Also,if you push a header all the way into place, it is covered up entirely on the bottom side. This idea of altering the position of holes to aid alignment will be further integrated into the Sparkfun Library for other footprints. It can help hold any component with 3 or more connection pins.; PROD_ID: CONN-08437
JP2 JP4 = Testing:PCB_THERMOCOUPLE: Circuit Board Thermocouple Connectors Glass-Filled Nylon 220°C (425°F) The PCC connector from OMEGA is perfect for bringing thermocouple probes to printed circuit boards. (OMEGA PCC-SMP) For type-k thermocouples.
K1-K4 = dbt_shield:G3MC-202PL-DC5: Solid State Relays - PCB Mount 5VDC/100-240VAC 2A Built-in snubber Source: Datasheet <https://componentsearchengine.com/Datasheets/1/G3MC-202PL-DC5.pdf>; DESCRIPTION: Solid State Relays - PCB Mount 5VDC/100-240VAC 2A Built-in snubber; HEIGHT: 20.5mm; MANUFACTURER_NAME: Omron Electronics; MANUFACTURER_PART_NUMBER: G3MC-202PL-DC5; MOUSER_PART_NUMBER: 653-G3MC-202PL-DC5; MOUSER_PRICE-STOCK: https://www.mouser.com/Search/Refine.aspx?Keyword=653-G3MC-202PL-DC5
L1-L4 = Inductor:L: Inductor Fixed - Generic; CATEGORY: Inductor; PROD_ID: NDUC-12579; SUB-CATEGORY: Fixed
LED1-LED4 = dbt_shield:LED: LED OSRAM: - CHIPLED LG R971, LG N971, LY N971, LG Q971, LY Q971, LO R971, LY R971 LH N974, LH R974 LS Q976, LO Q976, LY Q976 LO Q996 - Hyper CHIPLED LW Q18S LB Q993, LB Q99A, LB R99A - SideLED LS A670, LO A670, LY A670, LG A670, LP A670 LB A673, LV A673, LT A673, LW A673 LH A674 LY A675 LS A676, LA A676, LO A676, LY A676, LW A676 LS A679, LY A679, LG A679 - Hyper Micro SIDELED® LS Y876, LA Y876, LO Y876, LY Y876 LT Y87S - SmartLED LW L88C, LW L88S LB L89C, LB L89S, LG L890 LS L89K, LO L89K, LY L89K LS L896, LA L896, LO L896, LY L896 - TOPLED LS T670, LO T670, LY T670, LG T670, LP T670 LSG T670, LSP T670, LSY T670, LOP T670, LYG T670 LG T671, LOG T671, LSG T671 LB T673, LV T673, LT T673, LW T673 LH T674 LS T676, LA T676, LO T676, LY T676, LB T676, LH T676, LSB T676, LW T676 LB T67C, LV T67C, LT T67C, LS T67K, LO T67K, LY T67K, LW E67C LS E67B, LA E67B, LO E67B, LY E67B, LB E67C, LV E67C, LT E67C LW T67C LS T679, LY T679, LG T679 LS T770, LO T770, LY T770, LG T770, LP T770 LB T773, LV T773, LT T773, LW T773 LH T774 LS E675, LA E675, LY E675, LS T675 LS T776, LA T776, LO T776, LY T776, LB T776 LHGB T686 LT T68C, LB T68C - Hyper Mini TOPLED® LB M676 - Mini TOPLED Santana® LG M470 LS M47K, LO M47K, LY M47K Source: http://www.osram.convergy.de/
Q1-Q4 = dbt_shield:PMV40UN2R: MOSFET 30V N-channel Trench MOSFET Source: Datasheet <http://assets.nexperia.com/documents/data-sheet/PMV40UN2.pdf>; DESCRIPTION: MOSFET 30V N-channel Trench MOSFET; HEIGHT: 1.1mm; MANUFACTURER_NAME: Nexperia; MANUFACTURER_PART_NUMBER: PMV40UN2R; MOUSER_PART_NUMBER: 771-PMV40UN2R; MOUSER_PRICE-STOCK: https://www.mouser.co.uk/ProductDetail/Nexperia/PMV40UN2R?qs=sV%252BQJnSpgu%2Ftc99QGRzcMg%3D%3D; RS_PART_NUMBER: 1362196P; RS_PRICE-STOCK: http://uk.rs-online.com/web/p/products/1362196P
Q5-Q8 = dbt_shield:MMBT3904-7-F: NPN SMALL SIGNAL SURFACE MOUNT TRANSISTOR; AVAILABILITY: Unavailable; DESCRIPTION: TRANS NPN 40V 0.2A SMD SOT23-3; MF: Diodes Inc.; MP: MMBT3904-7-F; PACKAGE: SOT-23 Diodes Inc.; PRICE: None
R1-R79 = Resistor:R: Resistor Fixed - Generic; CATEGORY: Resistor; SUB-CATEGORY: Fixed
U1 = dbt_shield:R-78E5.0-1.0: Recom Power 5V 1A DC/DC Converter The Recom R-78E5.0-X.X is a compact DC/DC converter module that is a pin for pin drop-in replacement for the LM7805 linear voltage regulator. Specifications: Input Range: 7-28V Output Voltage: 5V Output Current: 1A Max Efficiency: 91% Datasheet <https://www.recom-power.com/pdf/Innoline/R-78Exx-1.0.pdf>; PROD_ID: COM-13655
U2 U3 = SparkFun-AnalogIC:MAX31855K: Cold-Junction-Compensated K-Thermocoupleto-Digital Converter (-270°C to +1800°C) The MAX31855K performs cold-junction compensation and digitizes the signal from a type-K thermocouple. The data is output in a 14-bit resolution, SPI™-compatible, read-only format. This converter resolves temperatures to 0.25°C, allows readings as high as +1800°C and as low as -270°C, and exhibits thermocouple accuracy of ±2°C for temperatures ranging from -200°C to +700°C for K-type thermocouples.; PROD_ID: IC-12578
U$1 = dbt_shield:1861991